# EAGLE design EC-TDS-PPM_V2-8 (EAGLE 7.5.0)
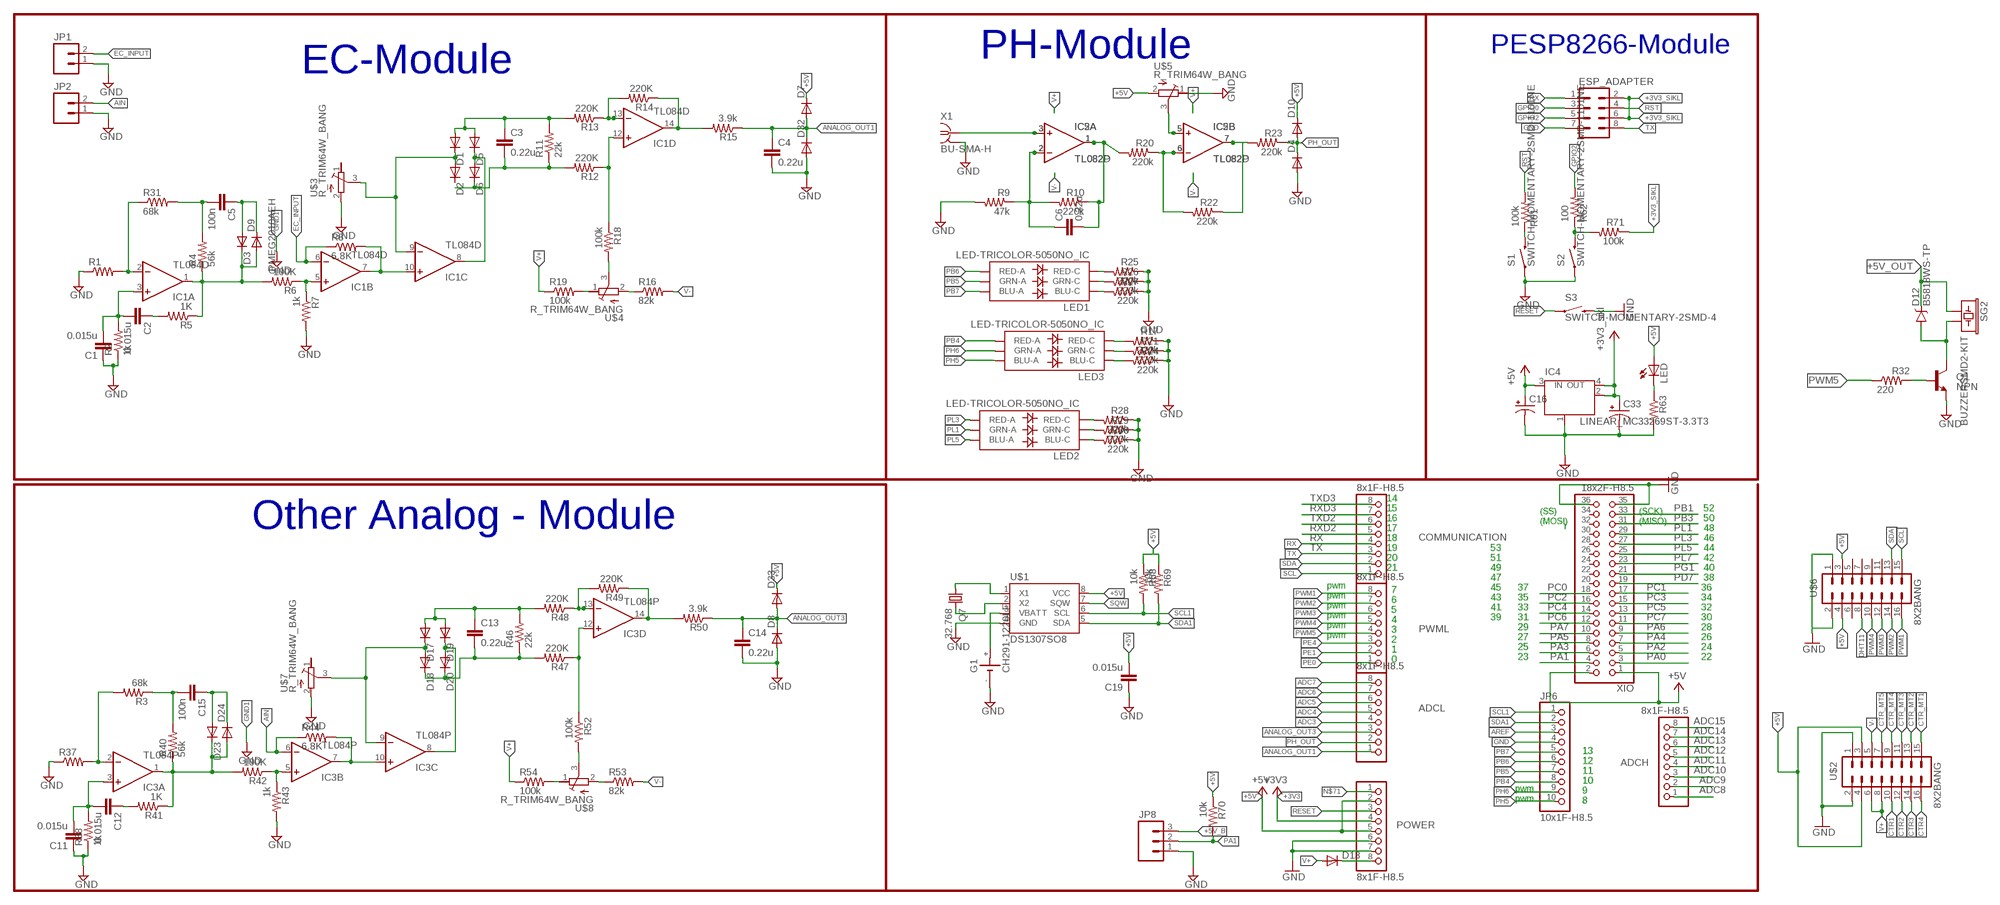
[diagram p0: schematic, sheet 1]

## Parts
ADCH  8x1F-H8.5  PINHD-1X8  [1X08]
ADCL  8x1F-H8.5  PINHD-1X8  [1X08]
C1  0.015u  C-EUC0603  [C0603]
C2  0.015u  C-EUC0603  [C0603]
C3  0.22u  C-EUC0603  [C0603]
C4  0.22u  C-EUC0603  [C0603]
C5  100n  C-EUC0603  [C0603]
C6  0.22u  C-EUC0603  [C0603]
C11  0.015u  C-EUC0603  [C0603]
C12  0.015u  C-EUC0603  [C0603]
C13  0.22u  C-EUC0603  [C0603]
C14  0.22u  C-EUC0603  [C0603]
C15  100n  C-EUC0603  [C0603]
C16  CPOL-USSMCC  [SMC_C]
C19  0.015u  C-EUC0603  [C0603]
C33  CPOL-USSMCC  [SMC_C]
COMMUNICATION  8x1F-H8.5  PINHD-1X8  [1X08]
D1  PMEG2010AEH  DIOD_SOT123F  [SOT123F]
D2  PMEG2010AEH  DIOD_SOT123F  [SOT123F]
D3  PMEG2010AEH  DIOD_SOT123F  [SOT123F]
D4  PMEG2010AEH  DIOD_SOT123F  [SOT123F]
D5  PMEG2010AEH  DIOD_SOT123F  [SOT123F]
D6  PMEG2010AEH  DIOD_SOT123F  [SOT123F]
D7  PMEG2010AEH  DIOD_SOT123F  [SOT123F]
D8  PMEG2010AEH  DIOD_SOT123F  [SOT123F]
D9  PMEG2010AEH  DIOD_SOT123F  [SOT123F]
D10  PMEG2010AEH  DIOD_SOT123F  [SOT123F]
D12  B5818WS-TP  DIODE-SCHOTTKY-BAT20J  [SOD-323]
D13  PMEG2010AEH  DIOD_SOT123F  [SOT123F]
D17  PMEG2010AEH  DIOD_SOT123F  [SOT123F]
D18  PMEG2010AEH  DIOD_SOT123F  [SOT123F]
D19  PMEG2010AEH  DIOD_SOT123F  [SOT123F]
D20  PMEG2010AEH  DIOD_SOT123F  [SOT123F]
D23  PMEG2010AEH  DIOD_SOT123F  [SOT123F]
D24  PMEG2010AEH  DIOD_SOT123F  [SOT123F]
D32  PMEG2010AEH  DIOD_SOT123F  [SOT123F]
D33  PMEG2010AEH  DIOD_SOT123F  [SOT123F]
ESP_ADAPTER  M04X2  [2X4]
G1  CH291-1220LF  [CH291-1220LF]
IC1  TL084D  [SO14]
IC2  TL082P  [DIL08]
IC3  TL084P  [DIL14]
IC4  LINEAR_MC33269ST-3.3T3  [LINEAR_SOT223]
IC5  TL082D  [SO08]
JP1  M025MM  [SCREWTERMINAL-5MM-2]
JP2  M025MM  [SCREWTERMINAL-5MM-2]
JP6  10x1F-H8.5  PINHD-1X10_ARD  [1X10]
JP8  M03PTH  [1X03]
LED  SPARKFUN_LED0603  [SPARKFUN_LED-0603]
LED1  LED-TRICOLOR-5050NO_IC  [LED-TRICOLOR-5050]
LED2  LED-TRICOLOR-5050NO_IC  [LED-TRICOLOR-5050]
LED3  LED-TRICOLOR-5050NO_IC  [LED-TRICOLOR-5050]
POWER  8x1F-H8.5  PINHD-1X8  [1X08]
PWML  8x1F-H8.5  PINHD-1X8  [1X08]
Q1  NPN  TRANSISTOR_NPNSOT23-3  [SOT23-3]
Q7  32.768  CRYTALTC38H  [TC38H]
R1  R-US_R0603  [R0603]
R2  1k  R-US_R0603  [R0603]
R3  68k  R-US_R0603  [R0603]
R4  56k  R-US_R0603  [R0603]
R5  1K  R-US_R0603  [R0603]
R6  100K  R-US_R0603  [R0603]
R7  1k  R-US_R0603  [R0603]
R8  6.8K  R-US_R0603  [R0603]
R9  47k  R-US_R0603  [R0603]
R10  220k  R-US_R0603  [R0603]
R11  22k  R-US_R0603  [R0603]
R12  220K  R-US_R0603  [R0603]
R13  220K  R-US_R0603  [R0603]
R14  220K  R-US_R0603  [R0603]
R15  3.9k  R-US_R0603  [R0603]
R16  82k  R-US_R0603  [R0603]
R17  220k  R-US_R0603  [R0603]
R18  100k  R-US_R0603  [R0603]
R19  100k  R-US_R0603  [R0603]
R20  220k  R-US_R0603  [R0603]
R21  220k  R-US_R0603  [R0603]
R22  220k  R-US_R0603  [R0603]
R23  220k  R-US_R0603  [R0603]
R24  220k  R-US_R0603  [R0603]
R25  220k  R-US_R0603  [R0603]
R26  220k  R-US_R0603  [R0603]
R27  220k  R-US_R0603  [R0603]
R28  220k  R-US_R0603  [R0603]
R29  220k  R-US_R0603  [R0603]
R30  220k  R-US_R0603  [R0603]
R31  68k  R-US_R0603  [R0603]
R32  220  RESISTOR0603-RES  [0603-RES]
R37  R-US_R0603  [R0603]
R38  1k  R-US_R0603  [R0603]
R40  56k  R-US_R0603  [R0603]
R41  1K  R-US_R0603  [R0603]
R42  100K  R-US_R0603  [R0603]
R43  1k  R-US_R0603  [R0603]
R44  6.8K  R-US_R0603  [R0603]
R46  22k  R-US_R0603  [R0603]
R47  220K  R-US_R0603  [R0603]
R48  220K  R-US_R0603  [R0603]
R49  220K  R-US_R0603  [R0603]
R50  3.9k  R-US_R0603  [R0603]
R52  100k  R-US_R0603  [R0603]
R53  82k  R-US_R0603  [R0603]
R54  100k  R-US_R0603  [R0603]
R61  100k  R-US_R0603  [R0603]
R62  100  R-US_R0603  [R0603]
R63  SPARKFUN_RESISTOR0603-RES  [SPARKFUN_0603-RES]
R68  10k  R-US_R0603  [R0603]
R69  10k  R-US_R0603  [R0603]
R70  10k  R-US_R0603  [R0603]
R71  100k  R-US_R0603  [R0603]
S1  SWITCH-MOMENTARY-2SMD-1101NE  [TACTILE-SWITCH-1101NE]
S2  SWITCH-MOMENTARY-2SMD-1101NE  [TACTILE-SWITCH-1101NE]
S3  SWITCH-MOMENTARY-2SMD-4  [TACTILE_SWITCH_TALL]
SG2  BUZZERSMD2-KIT  [BUZZER-CCV-KIT]
U$1  DS1307SO8  [SO08]
U$2  8X2BANG  [8X2BANG]
U$3  R_TRIM64W_BANG  [RTRIM64W_BANG]
U$4  R_TRIM64W_BANG  [RTRIM64W_BANG]
U$5  R_TRIM64W_BANG  [RTRIM64W_BANG]
U$6  8X2BANG  [8X2BANG]
U$7  R_TRIM64W_BANG  [RTRIM64W_BANG]
U$8  R_TRIM64W_BANG  [RTRIM64W_BANG]
X1  BU-SMA-H  [BU-SMA-H]
XIO  18x2F-H8.5  PINHD-2X18  [2X18]

## Nets
+3V3: POWER.4
+3V3_SIKL: C33.+ ESP_ADAPTER.2 ESP_ADAPTER.6 IC4.2(OUT) IC4.4(OUT) R71.1 ; supply symbol labelled +3V3_sikl
+5V: C16.+ C19.2 D7.C D10.C D33.C IC4.3(IN) LED.A POWER.2 POWER.5 R68.1 R69.1 R70.1 U$1.8(VCC) U$2.3 U$2.4 U$5.2(E) U$6.3 U$6.4
+5V_B: JP8.3 XIO.1 XIO.2 ; supply symbol labelled +5V
+5V_OUT: D12.C SG2.+
ADC3: ADCL.4
ADC4: ADCL.5
ADC5: ADCL.6
ADC6: ADCL.7
ADC7: ADCL.8
ADC8: ADCH.1
ADC9: ADCH.2
ADC10: ADCH.3
ADC11: ADCH.4
ADC12: ADCH.5
ADC13: ADCH.6
ADC14: ADCH.7
ADC15: ADCH.8
AIN: IC3.6(B:-IN) JP2.2 R44.1
ANALOG_OUT1: ADCL.1 C4.1 D7.A D32.C R15.1
ANALOG_OUT3: ADCL.3 C14.1 D8.C D33.A R50.1
AREF: JP6.3
CTR1: U$2.10
CTR2: U$2.12
CTR3: U$2.14
CTR4: U$2.16
CTR_MT1: U$2.15
CTR_MT2: U$2.13
CTR_MT3: U$2.11
CTR_MT4: U$2.9
CTR_MT5: U$2.7
DHT11: U$6.8
EC_INPUT: IC1.6(B:-IN) JP1.2 R8.1
GND: C1.1 C4.2 C11.1 C14.2 C16.- C19.1 C33.- D4.A D8.A D32.A ESP_ADAPTER.7 G1.- IC4.1(GND/ADJ) JP1.1 JP2.1 JP6.4 JP8.1 POWER.6 POWER.7 Q1.2(E) R1.1 R2.1 R7.2 R9.2 R17.1 R21.1 R24.1 R25.1 R26.1 R27.1 R28.1 R29.1 R30.1 R37.1 R38.1 R43.2 R63.2 S1.1 S2.1 S3.B2 U$1.4(GND) U$2.1 U$2.2 U$3.2(E) U$6.1 U$6.2 U$7.2(E) X1.2 X1.3 X1.4 X1.5 XIO.35 XIO.36
GND1: U$5.1(A) ; supply symbol labelled GND
GPIO0: ESP_ADAPTER.3
GPIO2: ESP_ADAPTER.5 R62.2
N$1: IC1.2(A:-IN) R1.2 R31.1
N$2: C2.1 R5.2
N$3: C1.2 C2.2 IC1.3(A:+IN) R2.2
N$4: IC1.5(B:+IN) R6.1 R7.1
N$5: C5.2 R4.2 R31.2
N$6: R16.1 U$4.2(E)
N$7: D3.C D9.A IC1.1(A:OUT) R4.1 R5.1 R6.2
N$8: C5.1 D3.A D9.C
N$9: IC1.7(B:OUT) IC1.10(C:+IN) R8.2
N$10: R19.2 U$4.1(A)
N$11: IC1.13(D:-IN) R13.1 R14.2
N$12: C3.1 D1.A D5.A R11.2 R13.2
N$13: D1.C D2.A IC1.9(C:-IN) U$3.3(S)
N$14: C3.2 D6.C R11.1 R12.2
N$15: D5.C D6.A IC1.8(C:OUT)
N$16: IC1.12(D:+IN) R12.1 R18.1
N$17: IC1.14(D:OUT) R14.1 R15.2
N$18: R18.2 U$4.3(S)
N$19: IC2.5(B:+IN) IC5.5(B:+IN) U$5.3(S)
N$20: IC2.6(B:-IN) IC5.6(B:-IN) R20.1 R22.2
N$21: C6.1 IC2.2(A:-IN) IC5.2(A:-IN) R9.1 R10.2
N$22: C6.2 IC2.1(A:OUT) IC5.1(A:OUT) R10.1 R20.2
N$23: IC2.7(B:OUT) IC5.7(B:OUT) R22.1 R23.2
N$24: IC2.3(A:+IN) IC5.3(A:+IN) X1.1
N$25: LED3.5(RED-C) R17.2
N$26: LED3.6(GRN-C) R21.2
N$27: LED2.5(RED-C) R28.2
N$28: LED2.6(GRN-C) R29.2
N$29: LED2.4(BLU-C) R30.2
N$30: LED3.4(BLU-C) R24.2
N$31: LED1.5(RED-C) R25.2
N$32: LED1.6(GRN-C) R26.2
N$33: LED1.4(BLU-C) R27.2
N$35: Q1.1(B) R32.2
N$36: D12.A Q1.3(C) SG2.-
N$37: IC3.2(A:-IN) R3.2 R37.2
N$38: C11.2 C12.2 IC3.3(A:+IN) R38.2
N$39: C15.2 R3.1 R40.2
N$40: D23.C D24.A IC3.1(A:OUT) R40.1 R41.1 R42.2
N$41: C12.1 R41.2
N$42: IC3.5(B:+IN) R42.1 R43.1
N$43: IC3.7(B:OUT) IC3.10(C:+IN) R44.2
N$44: C13.1 D17.A D19.A R46.2 R48.2
N$45: D17.C D18.A IC3.9(C:-IN) U$7.3(S)
N$46: C13.2 D18.C D20.C R46.1 R47.2
N$47: D19.C D20.A IC3.8(C:OUT)
N$48: IC3.13(D:-IN) R48.1 R49.2
N$49: IC3.12(D:+IN) R47.1 R52.1
N$50: IC3.14(D:OUT) R49.1 R50.2
N$51: C15.1 D23.A D24.C
N$52: R53.1 U$8.2(E)
N$53: R54.2 U$8.1(A)
N$54: R52.2 U$8.3(S)
N$55: D13.C POWER.8
N$62: R61.1 S1.2
N$63: R62.1 R71.2 S2.2
N$64: LED.C R63.1
N$68: Q7.1 U$1.1(X1)
N$69: Q7.2 U$1.2(X2)
N$71: POWER.1
N$72: G1.+ U$1.3(VBATT)
PA0: XIO.3
PA1: JP8.2 R70.2 XIO.4
PA2: XIO.5
PA3: XIO.6
PA4: XIO.7
PA5: XIO.8
PA6: XIO.9
PA7: XIO.10
PB1: XIO.33
PB3: XIO.31
PB4: JP6.8 LED3.2(RED-A)
PB5: JP6.7 LED1.1(GRN-A)
PB6: JP6.6 LED1.2(RED-A)
PB7: JP6.5 LED1.3(BLU-A)
PC0: XIO.18
PC1: XIO.17
PC2: XIO.16
PC3: XIO.15
PC4: XIO.14
PC5: XIO.13
PC6: XIO.12
PC7: XIO.11
PD7: XIO.19
PE0: PWML.1
PE1: PWML.2
PE4: PWML.3
PG1: XIO.21
PH5: JP6.10 LED3.3(BLU-A)
PH6: JP6.9 LED3.1(GRN-A)
PH_OUT: ADCL.2 D4.C D10.A R23.1
PL1: LED2.1(GRN-A) XIO.29
PL3: LED2.2(RED-A) XIO.27
PL5: LED2.3(BLU-A) XIO.25
PL7: XIO.23
PWM1: PWML.8 U$6.16
PWM2: PWML.7 U$6.14
PWM3: PWML.6 U$6.12
PWM4: PWML.5 U$6.10
PWM5: PWML.4 R32.1
RESET: POWER.3 S3.A2
RST: ESP_ADAPTER.4 R61.2
RX: COMMUNICATION.4 ESP_ADAPTER.1
RXD2: COMMUNICATION.5
RXD3: COMMUNICATION.7
SCL: COMMUNICATION.1 U$6.15
SCL1: JP6.1 R68.2 U$1.6(SCL)
SDA: COMMUNICATION.2 U$6.13
SDA1: JP6.2 R69.2 U$1.5(SDA)
SQW: U$1.7(SQW)
TX: COMMUNICATION.3 ESP_ADAPTER.8
TXD2: COMMUNICATION.6
TXD3: COMMUNICATION.8
V+: D13.A R19.1 R54.1 U$2.6 U$2.8
V-: R16.2 R53.2 U$2.5
Unconnected: D2.C U$3.1(A) U$6.5 U$6.6 U$6.7 U$6.9 U$6.11 U$7.1(A) XIO.20 XIO.22 XIO.24 XIO.26 XIO.28 XIO.30 XIO.32 XIO.34

## Notes on the sheet
- PH-Module | PESP8266-Module
- EC-Module
- 14
- 15 | (SS) | (SCK) | 52
- 16 | (MOSI) | (MISO) | 50
- Other Analog - Module | 17 | 48
- 18 | 46
- 19 | 53 | 44
- 20 | 51 | 42
- 21 | 49 | 40
- 47 | 38
- pwm | 45 | 37 | 36
- 7
- pwm | 43 | 35 | 34
- 6
- pwm | 41 | 33 | 32
- 5
- pwm | 39 | 31 | 30
- 4
- pwm | 29 | 28
- 3
- pwm | 27 | 26
- 2
- 1 | 25 | 24
- 0 | 23 | 22
- 13
- 12
- 11
- 10
- pwm | 9
- pwm | 8

## Power pins joined to a net without a drawn wire
V+: IC1.4(P:V+) IC2.8(P:V+) IC3.4(P:V+) IC5.8(P:V+)
V-: IC1.11(P:V-) IC2.4(P:V-) IC3.11(P:V-) IC5.4(P:V-)

## Library data of the parts
ADCH ADCL COMMUNICATION POWER PWML = SmartPrj:PINHD-1X8: PIN HEADER
C1-C6 C11-C15 C19 = resistor:C-EU: CAPACITOR, European symbol
C16 C33 = rcl:CPOL-US: POLARIZED CAPACITOR, American symbol
D1-D10 D13 D17-D20 D23 D24 D32 D33 = Enleka_Diode:DIOD_SOT123F; PARTNO: PMEG2010AEH,115
D12 = SparkFun-DiscreteSemi:DIODE-SCHOTTKY: Schottky diodes in SFE's production catalog BAT20J 1A 23V 0.62Vf RB751 120mA 40V 0.37Vf PMEG4005EJ 0.5A 40V 0.42Vf MBRA140 1A 40V 0.5Vf B340A 3A 40V SMA; PARTNO: BAT20JFILM; PROD_ID: DIO-11623; VALUE: BAT20J
ESP_ADAPTER = SparkFun-Connectors:M04X2: .1" header, two rows of four.
G1 = battery:CH291-1220LF: Battery Holder, SMT, 12mm multicomp PART NO. CH291-1220LF Source: Data sheet <http://www.farnell.com/datasheets/1505860.pdf>
IC1 IC3 = linear:TL084: OP AMP
IC2 IC5 = linear:TL082: OP AMP Data sheet <http://www.ti.com/lit/ds/symlink/tl084a . pdf>; DATA_SHEET: <a href="http://www.ti.com/lit/ds/symlink/tl084a.pdf"> Data sheet </a>
IC4 = Robotech_Other:LINEAR_MC33269ST*: Adjustable Output Low Dropout Voltage Regulator 800 mA Source: http://www.onsemi.com/pub/Collateral/MC33269-D.PDF
JP1 JP2 = SparkFun-Connectors:M02: Standard 2-pin 0.1" header. Use with - straight break away headers ( PRT-00116) - right angle break away headers (PRT-00553) - swiss pins (PRT-00743) - machine pins (PRT-00117) - female headers (PRT-00115) Molex polarized connector foot print use with: PRT-08233 with associated crimp pins and housings. 2.54_SCREWTERM for use with PRT-10571. 3.5mm Screw Terminal footprints for PRT-08084 5mm Screw Terminal footprints for use with PRT-08432; STOREFRONT_ID: PRT-08432
JP6 = SmartPrj:PINHD-1X10_ARD: PIN HEADER
JP8 = SparkFun-Connectors:M03: Header 3 Standard 3-pin 0.1" header. Use with straight break away headers (SKU : PRT-00116), right angle break away headers (PRT-00553), swiss pins (PRT-00743), machine pins (PRT-00117), and female headers (PRT-00115). Molex polarized connector foot print use with SKU : PRT-08232 with associated crimp pins and housings.
LED = Robotech RLC of Chung:SPARKFUN_LED: LEDs Standard schematic elements and footprints for 5mm, 3mm, 1206, and 0603 sized LEDs. 5mm - Spark Fun Electronics SKU : COM-00529 (and others)
LED1-LED3 = SparkFun-LED:LED-TRICOLOR-5050
Q1 = SparkFun-DiscreteSemi:TRANSISTOR_NPN: Generic NPN BJT MMBT2222A - TRANS-08049 (SOT-23, 1A 40V) MPSA42 - TRANS-09116 (SOT-23, 500mA 300V) MMBT5088LT1G - TRANS-11160 (SOT-23, 50 mA 30V) BC547 - COM-08928 <http://www.sparkfun.com/products/8928> (TO-92 45V 100mA) (1.Collector 2.Base 3.Emitter) 2N3904 - COM-00521 <http://www.sparkfun.com/products/521> (TO-92 40V 200mA) (1.Emitter 2.Base 3.Collector) P2N2222A - COM-12852 <http://www.sparkfun.com/products/12852> (TO-92 40V 600mA) (1.Collector 2.Base 3.Emitter); PARTNO: 2SD1048-6-TB-E; PROD_ID: TRANS-08049
Q7 = crystal:CRYTAL: CRYSTAL
R1-R31 R37 R38 R40-R44 R46-R50 R52-R54 R61 R62 R68-R71 = resistor:R-US_: RESISTOR, American symbol
R32 = pixhawk2:RESISTOR: Resistor Basic schematic elements and footprints for 0603, 1206, and PTH 1/10th watt (small) resistors.; PARTNO: RT0402DRE079K09L
R63 = Robotech_RCL:SPARKFUN_RESISTOR: Resistor Basic schematic elements and footprints for 0603, 1206, and PTH resistors.
S1 S2 = SparkFun-Electromechanical:SWITCH-MOMENTARY-2: Various NO switches- pushbuttons, reed, etc; PROD_ID: SWCH-00815
S3 = SparkFun-Electromechanical:SWITCH-MOMENTARY-2: Various NO switches- pushbuttons, reed, etc; PROD_ID: SWCH-11966
SG2 = buzzer-greentura:BUZZER: Buzzer 12mm Spark Fun Electronics SKU : Comp-Buzzer
U$1 = SparkFun-FreqCtrl:DS1307: I2C real-time clock with battery backup.
U$2 U$6 = SparkFun-Connectors:8X2BANG
U$3-U$5 U$7 U$8 = rtrim:R_TRIM64W_BANG
X1 = con-coax:BU-SMA-H: FEMALE SMA CONNECTOR Radiall; OC_FARNELL: unknown; OC_NEWARK: unknown
XIO = SmartPrj:PINHD-2X18: PIN HEADER

## Net classes
0 default: width 0.178 mm, drill 0.381 mm, clearance 0.178 mm
1 power: width 0.15 mm, drill 0.2 mm, clearance 0.152 mm
2 gnd: width 0.305 mm, drill 0.406 mm, clearance 0.203 mm
3 power usb: width 0.508 mm, drill 0.406 mm, clearance 0.203 mm

## Board
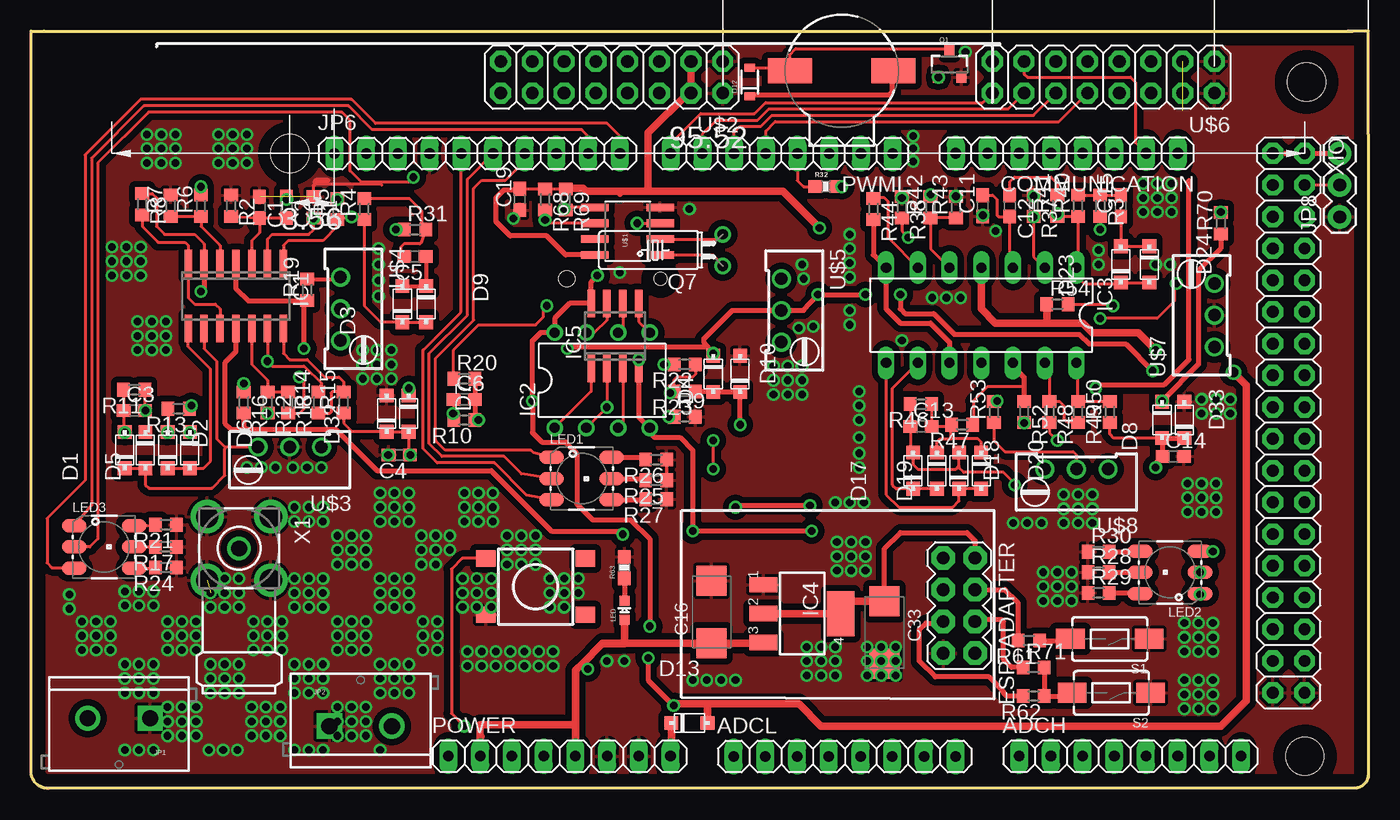
[diagram p1: board, top side]
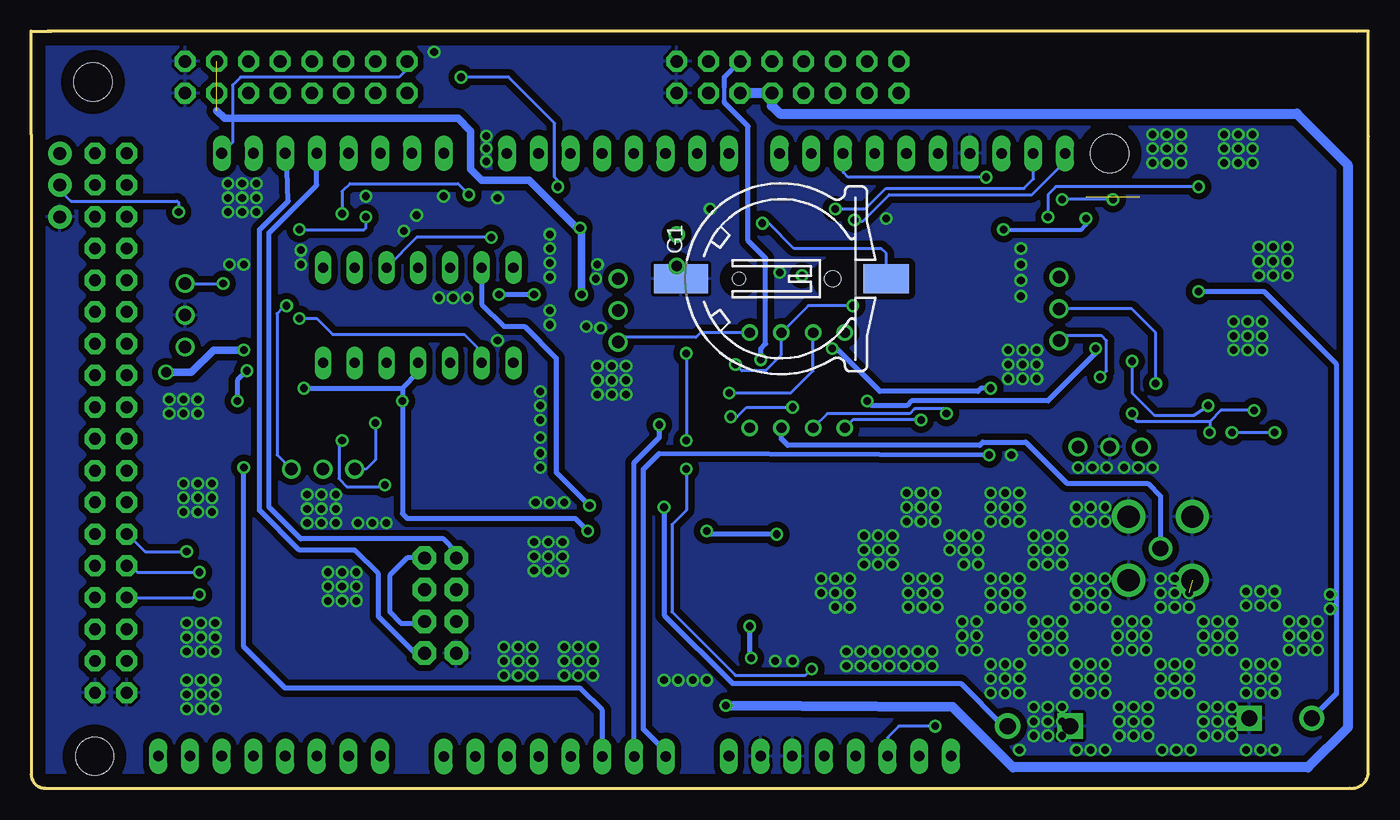
[diagram p2: board, bottom side, seen from below]

Size 107.06 x 60.6 mm. Coordinates in mm from the lower left corner, seen from the top.
Outline: 0,52.19 0,1.14 arc90 1.51,0.01 105.97,0.01 arc90 107.06,1.11 107.06,52.33
Outline: 0.91,60.59 105.79,60.59
Outline: 0,52.21 0,60.6 1.02,60.6
Outline: 107.06,52.34 107.06,60.6 105.41,60.6
Copper layers (1*16): Top 0.035mm / dielectric 1.5mm / Bottom 0.035mm
Design rules "default *": minimum track width 10mil, minimum drill 24mil, track to track 10mil, track to pad 10mil, pad to pad 10mil, via to via 10mil, smd to smd 8mil, copper to edge 40mil, drill to drill 8mil, minimum pad ring 10mil, minimum via ring 8mil, stop-mask expansion 4mil, vias tented up to drill 100mil, thermal gap 10mil
Holes 3.05 mm at 20.7,50.82 101.98,2.56 102.11,56.53

### Footprints (pad centres in the part's own frame; a part is rotated, then mirrored left to right if it is on the bottom)
1X08 = drill 0.85 pad 1.422 long: 1 -8.89,0; 2 -6.35,0; 3 -3.81,0; 4 -1.27,0; 5 1.27,0; 6 3.81,0; 7 6.35,0; 8 8.89,0
C0603 = smd 1.1 x 1: 1 -0.85,0; 2 0.85,0
SMC_C = smd 2.4 x 2.4: + -2.5,0; - 2.5,0
SOT123F = smd 1.1 x 1.1: A 1.45,0; C -1.45,0
SOD-323 = smd 0.63 x 0.83: A 1.15,0; C -1.15,0
2X4 = drill 1.016 pad 1.88 octagon: 1 -3.81,-1.27; 2 -3.81,1.27; 3 -1.27,-1.27; 4 -1.27,1.27; 5 1.27,-1.27; 6 1.27,1.27; 7 3.81,-1.27; 8 3.81,1.27
CH291-1220LF = smd 2.3 x 3.66: + 0,-2.296 | smd 2.3 x 4.3: - 0,14.146 | hole 1.3: 0,2 | hole 1: 0,9.5
SO14 = smd 0.6 x 2.2: 1 -3.81,-2.6; 2 -2.54,-2.6; 3 -1.27,-2.6; 4 0,-2.6; 5 1.27,-2.6; 6 2.54,-2.6; 7 3.81,-2.6; 8 3.81,2.6; 9 2.54,2.6; 10 1.27,2.6; 11 0,2.6; 12 -1.27,2.6; 13 -2.54,2.6; 14 -3.81,2.6
DIL08 = drill 0.813 pad 1.27: 1 -3.81,-3.81; 2 -1.27,-3.81; 3 1.27,-3.81; 4 3.81,-3.81; 5 3.81,3.81; 6 1.27,3.81; 7 -1.27,3.81; 8 -3.81,3.81
DIL14 = drill 0.813 long: 1 -7.62,-3.81; 2 -5.08,-3.81; 3 -2.54,-3.81; 4 0,-3.81; 5 2.54,-3.81; 6 5.08,-3.81; 7 7.62,-3.81; 8 7.62,3.81; 9 5.08,3.81; 10 2.54,3.81; 11 0,3.81; 12 -2.54,3.81; 13 -5.08,3.81; 14 -7.62,3.81
LINEAR_SOT223 = smd 1.219 x 2.235: 1 -2.311,-3.099; 2 0,-3.099; 3 2.311,-3.099 | smd 3.6 x 2.2: 4 0,3.099
SO08 = smd 0.6 x 2.2: 1 -1.905,-2.6; 2 -0.635,-2.6; 3 0.635,-2.6; 4 1.905,-2.6; 5 1.905,2.6; 6 0.635,2.6; 7 -0.635,2.6; 8 -1.905,2.6
SCREWTERMINAL-5MM-2 = drill 1.3 pad 2.032 square: 1 0,0 | drill 1.3 pad 2.032: 2 5,0
1X10 = drill 0.85 pad 1.422 long: 1 -11.43,0; 2 -8.89,0; 3 -6.35,0; 4 -3.81,0; 5 -1.27,0; 6 1.27,0; 7 3.81,0; 8 6.35,0; 9 8.89,0; 10 11.43,0
1X03 = drill 1.016 pad 1.88: 1 0,0; 2 2.54,0; 3 5.08,0
SPARKFUN_LED-0603 = smd 0.8 x 0.8: A 0,-0.75; C 0,0.75
LED-TRICOLOR-5050 = smd 2 x 1.1: 1 -2.4,1.7; 2 -2.4,0; 3 -2.4,-1.7; 4 2.4,-1.7; 5 2.4,0; 6 2.4,1.7
SOT23-3 = smd 0.8 x 0.9: 1 -0.95,-1; 2 0.95,-1; 3 0,1.1
TC38H = drill 0.813: 1 -1.27,0; 2 1.27,0
R0603 = smd 1 x 1.1: 1 -0.85,0; 2 0.85,0
0603-RES = smd 1.1 x 1: 1 -0.85,0; 2 0.85,0
SPARKFUN_0603-RES = smd 1.1 x 1: 1 -0.85,0; 2 0.85,0
TACTILE-SWITCH-1101NE = smd 2.3 x 1.6: 1 -3.15,0; 2 3.15,0
TACTILE_SWITCH_TALL = smd 1.55 x 1.3: A1 -3.975,-2.25; A2 3.975,-2.25; B1 -3.975,2.25; B2 3.975,2.25
BUZZER-CCV-KIT = smd 3.5 x 2: + 4.15,0; - -4.15,0
SO08' = smd 0.61 x 2.21: 1 -1.905,-2.616; 2 -0.635,-2.616; 3 0.635,-2.616; 4 1.905,-2.616; 5 1.905,2.616; 6 0.635,2.616; 7 -0.635,2.616; 8 -1.905,2.616
8X2BANG = drill 1.016 pad 1.676 octagon: 1 0,0; 2 0,2.54; 3 2.54,0; 4 2.54,2.54; 5 5.08,0; 6 5.08,2.54; 7 7.62,0; 8 7.62,2.54; 9 10.16,0; 10 10.16,2.54; 11 12.7,0; 12 12.7,2.54; 13 15.24,0; 14 15.24,2.54; 15 17.78,0; 16 17.78,2.54
RTRIM64W_BANG = drill 1: 1 2.54,-2.54; 2 2.54,0; 3 2.54,2.54
BU-SMA-H = drill 1.27: 1 0,0 | drill 1.778: 2 -2.55,2.55; 3 2.55,2.55; 4 2.55,-2.55; 5 -2.55,-2.55
2X18 = drill 0.95 pad 1.676 octagon: 1 -21.59,-1.27; 2 -21.59,1.27; 3 -19.05,-1.27; 4 -19.05,1.27; 5 -16.51,-1.27; 6 -16.51,1.27; 7 -13.97,-1.27; 8 -13.97,1.27; 9 -11.43,-1.27; 10 -11.43,1.27; 11 -8.89,-1.27; 12 -8.89,1.27; 13 -6.35,-1.27; 14 -6.35,1.27; 15 -3.81,-1.27; 16 -3.81,1.27; 17 -1.27,-1.27; 18 -1.27,1.27; 19 1.27,-1.27; 20 1.27,1.27; 21 3.81,-1.27; 22 3.81,1.27; 23 6.35,-1.27; 24 6.35,1.27; 25 8.89,-1.27; 26 8.89,1.27; 27 11.43,-1.27; 28 11.43,1.27; 29 13.97,-1.27; 30 13.97,1.27; 31 16.51,-1.27; 32 16.51,1.27; 33 19.05,-1.27; 34 19.05,1.27; 35 21.59,-1.27; 36 21.59,1.27

### Placement (x,y rotation side)
ADCH  88,2.57 0 top
ADCL  65.14,2.54 0 top
C1  18.29,46.5 270 top
C2  20.45,46.5 270 top
C3  8.25,30.24 0 top
C4  29.46,26.69 180 top
C5  30.73,42.56 180 top
C6  34.67,31.13 0 top
C11  76.2,46.63 90 top
C12  78.36,46.63 270 top
C13  71.25,28.97 0 top
C14  91.44,26.56 0 top
C15  87.25,46.63 90 top
C16  54.48,14.11 90 top
C19  39.12,47.13 90 top
C33  68.33,12.46 270 top
COMMUNICATION  82.92,50.83 180 top
D1  7.49,27.07 90 top
D2  9.14,27.07 270 top
D3  29.72,38.75 90 top
D4  56.77,33.16 90 top
D5  10.92,27.07 90 top
D6  12.7,27.07 270 top
D7  30.23,29.99 270 top
D8  92.33,29.48 90 top
D9  31.62,38.75 270 top
D10  54.61,33.16 270 top
D12  57.53,56.53 90 top
D13  52.7,5.22 0 top
D17  70.61,25.42 90 top
D18  72.52,25.42 270 top
D19  74.3,25.42 90 top
D20  76.07,25.42 270 top
D23  87.25,41.93 90 top
D24  89.54,41.93 270 top
D32  28.45,29.99 90 top
D33  90.55,29.48 270 top
ESP_ADAPTER  74.3,14.62 270 top
G1  40.89,40.78 90 bottom
IC1  16.38,39.39 180 top
IC2  45.72,32.66 0 top
IC3  76.07,37.86 180 top
IC4  61.72,13.99 270 top
IC5  46.74,36.21 0 top
JP1  9.52,5.61 180 top
JP2  23.88,4.97 0 top
JP6  35.71,50.82 0 top
JP8  104.78,45.74 90 top
LED  47.5,14.24 0 top
LED1  44.07,24.78 0 top
LED2  91.19,17.29 180 top
LED3  5.84,19.32 0 top
POWER  42.3,2.57 0 top
PWML  60.08,50.8 180 top
Q1  73.53,57.93 0 top
Q7  55.37,43.07 90 top
R1  22.61,46.5 270 top
R2  16,46.63 270 top
R3  85.6,46.63 270 top
R4  26.67,46.37 90 top
R5  24.51,46.37 90 top
R6  13.59,46.63 90 top
R7  11.18,46.63 90 top
R8  8.89,46.75 270 top
R9  52.32,29.74 0 top
R10  34.67,29.48 180 top
R11  8.25,31.89 180 top
R12  18.92,30.88 270 top
R13  11.81,30.37 180 top
R14  22.99,30.88 90 top
R15  25.02,30.88 90 top
R16  17.02,30.88 270 top
R17  10.79,19.32 180 top
R18  20.57,30.88 270 top
R19  22.1,39.9 90 top
R20  34.67,32.78 0 top
R21  10.79,21.1 180 top
R22  52.32,33.93 180 top
R23  52.32,31.77 180 top
R24  10.79,17.67 180 top
R25  50.04,24.66 180 top
R26  50.04,26.31 180 top
R27  50.04,23.13 180 top
R28  85.47,17.29 0 top
R29  85.47,15.64 0 top
R30  85.47,18.94 0 top
R31  30.73,44.72 0 top
R32  63.63,48.15 0 top
R37  80.26,46.63 270 top
R38  69.72,46.5 270 top
R40  83.82,46.63 90 top
R41  82.17,46.63 90 top
R42  72.01,46.5 90 top
R43  74.04,46.5 90 top
R44  67.44,46.37 270 top
R46  71.25,30.75 180 top
R47  74.55,29.1 180 top
R48  81.53,30.12 270 top
R49  83.82,30.12 270 top
R50  86.36,30.12 90 top
R52  79.5,30.12 270 top
R53  77.09,30.12 90 top
R54  82.17,38.75 0 top
R61  79.88,11.83 180 top
R62  80.26,7.38 180 top
R63  47.5,17.67 90 top
R68  41.15,47.13 270 top
R69  42.8,47.13 270 top
R70  95.25,45.23 90 top
R71  80.26,9.67 0 top
S1  86.36,11.96 180 top
S2  86.49,7.64 180 top
S3  40.39,16.15 180 top
SG2  64.9,57.42 0 top
U$1  DS1307SO8  [SO08']  47.75,44.59 90 top
U$2  55.37,58.18 180 top
U$3  20.7,24.78 90 top
U$4  27.3,38.37 180 top
U$5  62.61,38.24 180 top
U$6  94.74,58.18 180 top
U$7  92.2,37.86 0 top
U$8  83.69,23 90 top
X1  16.64,19.19 270 top
XIO  100.69,29.24 270 top

### Tracks (layer width: path | path; a pad name or v marks a point on that pad's centre or on a via)
+3V3_SIKL
  Top 0.381: C33.+ 68.33,19.19 69.6,20.46 74.93,20.46 75.56,19.83 ESP_ADAPTER.2 | R71.1 78.49,9.67 77.85,10.3 77.85,13.35 77.72,13.48 75.69,13.48 ESP_ADAPTER.6 | IC4.4 64.82,14.67 65.02,14.88
  Top 0.61: IC4.2 IC4.4 | C33.+ 64.22,14.96 64.01,14.75 64.75,14.75 64.82,14.67
  Bottom 0.381: ESP_ADAPTER.2 76.96,18.43 78.36,17.04 78.36,14.11 77.47,13.23 75.69,13.23 ESP_ADAPTER.6
+5V  (via drill 0.61)  (2 unrouted)
  Top 0.254: D10.C v54.61,34.82 | v54.61,27.83 v54.61,25.54 | v44.58,9.54 44.13,9.99 | C19.2 R68.1 R69.1
  Top 0.381: v66.8,39.51 v62.99,39.51 61.85,38.24 U$5.2 56.13,38.24 53.85,35.96 53.85,35.7 v54.61,34.82 | v89.79,33.42 87.63,35.58 84.71,35.58 83.95,36.34 73.91,36.34 72.26,37.99 69.98,37.99 69.6,38.37 v69.6,39.51 | D33.C v90.55,31.01 93.47,33.93 93.47,41.42 95.25,43.2 R70.1 | v42.93,35.2 43.18,35.07 43.43,35.32 54.15,35.32 D10.C | 47.12,47.52 47.37,47.77 | U$1.8 42.8,42.69 41.27,44.21 38.35,44.21 37.21,45.36 37.21,47.26 37.85,47.9 39.03,47.9 C19.2 | D7.C v30.23,32.02
  Top 0.61: LED.A 47.5,11.57 45.72,11.57 | IC4.3 58.78,11.83 59.18,11.83 58.97,11.61 C16.+ 45.76,11.61 45.72,11.57 | POWER.5 43.57,5.22 | 43.57,5.22 43.57,9.43 44.13,9.99 45.72,11.57 | POWER.2 35.95,4.08 | 35.95,4.08 35.95,4.48 35.94,5.1 43.45,5.1 43.57,5.22 | 36.02,4.14 35.95,4.08 | U$2.3 U$2.4 52.58,55.64 49.4,52.47 49.4,47.77 | 49.4,47.77 60.2,47.77 v63.12,44.85 | 49.4,47.77 47.37,47.77 44.45,47.77 44.2,48.02 42.84,48.02 R69.1
  Bottom 0.254: v54.61,34.82 v54.61,27.83 | v54.61,25.54 54.61,22.24 55.75,21.1 55.75,14.11 50.67,9.03 45.09,9.03 v44.58,9.54
  Bottom 0.381: 62.99,44.98 v63.12,44.85 | v66.8,39.51 v69.6,39.51 | v89.79,33.42 90.55,32.66 v90.55,31.01 | v30.23,32.02 30.99,32.02 31.24,31.77 39.12,31.77 42.42,35.07 v42.93,35.2
  Bottom 0.61: v62.99,39.51 62.99,44.98 63.5,44.98 67.18,48.66 70.99,48.66 71.88,49.55 71.88,52.6 72.9,53.61 91.57,53.61 92.2,54.25
+5V_B
  Top 0.381: XIO.1 XIO.2 104.76,50.83 JP8.3
+5V_OUT
  Top 0.254: 69.09,57.38 SG2.+ | D12.C 57.65,55.38 57.78,55.52
  Top 0.381: 57.78,55.52 68.71,55.52 68.96,55.77 68.96,57.34 SG2.+
AIN  (via drill 0.61)
  Top 0.254: IC3.6 68.58,44.09 68.58,47.01 68.33,47.26 67.48,47.26 R44.1
  Top 0.381: v62.36,22.62 56.52,22.62 v56.39,22.5
  Bottom 0.381: IC3.6 70.99,38.75 69.22,36.97 67.56,36.97 65.02,34.43 65.02,25.29 v62.36,22.62 | v56.39,22.5 56.39,13.86 50.93,8.4 32.64,8.4 29.34,5.1 29.13,5.1 JP2.2
ANALOG_OUT1  (via drill 0.61)
  Top 0.254: C4.1 30.23,26.78 D7.A D32.C 28.39,28.59 25.65,28.59 25.02,29.23 R15.1
  Top 0.381: v30.35,26.69 C4.1
  Bottom 0.381: ADCL.1 56.25,2.93 58.04,4.72 58.04,25.54 56.77,26.81 v30.35,26.69
ANALOG_OUT3  (via drill 0.61)
  Top 0.254: D33.A 86.67,28.03 86.36,28.34 R50.1
  Top 0.381: 90.04,25.58 v90.04,25.67 90.04,26.01 C14.1 90.55,26.6 D33.A D8.C
  Bottom 0.381: ADCL.3 61.33,6.23 63.12,8.02 86.74,8.02 90.04,11.32 v90.04,25.67
EC_INPUT  (via drill 0.61)
  Top 0.254: R8.1 9.69,47.6 10.03,47.26 10.03,44.98 10.67,44.34 13.08,44.34 13.84,43.58 IC1.6
  Top 0.381: IC1.6 13.84,40.02 v13.59,39.77
  Bottom 0.381: v13.59,39.77 8.38,39.77 2.54,33.93 2.54,7.59 JP1.2
GND  (via drill 0.61)  (2 unrouted)
  Top 0.254: R26.1 R25.1 | 23.75,48.66 23.62,48.79 23.24,48.79 22.61,48.15 R1.1 22.61,48.28 22.73,48.4 27.94,48.4 28.07,48.28
  Top 0.381: 23.75,48.66 22.86,48.66 22.73,48.53
  other vias: 46.1,10.18 47.5,10.18 52.96,8.65 54.1,8.65 55.24,8.65 56.39,8.65 34.92,9.8 36.07,9.8 37.21,9.8 38.35,9.8 39.5,9.8 40.64,9.8 41.78,9.8 34.92,10.94 36.07,10.94 37.21,10.94 38.35,10.94 39.5,10.94 40.64,10.94 41.78,10.94 62.1,11.32 63.25,11.32 64.39,11.32 62.1,10.18 63.25,10.18 64.39,10.18 66.93,11.32 68.07,11.32 69.22,11.32 66.93,10.18 68.07,10.18 69.22,10.18 93.73,31.13 94.87,31.13 96.01,31.13 93.73,29.99 94.87,29.99 96.01,29.99 92.33,10.94 93.47,10.94 94.62,10.94 92.33,13.23 93.47,13.23 94.62,13.23 92.33,12.08 93.47,12.08 94.62,12.08 92.33,8.65 93.47,8.65 94.62,8.65 92.33,7.51 93.47,7.51 94.62,7.51 92.58,22.12 93.73,22.12 94.87,22.12 92.58,24.4 93.73,24.4 94.87,24.4 92.58,23.26 93.73,23.26 94.87,23.26 81.03,15 82.17,15 83.31,15 81.03,17.29 82.17,17.29 83.31,17.29 81.03,16.15 82.17,16.15 83.31,16.15 59.44,31.51 60.58,31.51 61.72,31.51 59.44,33.8 60.58,33.8 61.72,33.8 59.44,32.66 60.58,32.66 61.72,32.66 8.51,35.07 9.65,35.07 10.79,35.07 8.51,37.36 9.65,37.36 10.79,37.36 8.51,36.21 9.65,36.21 10.79,36.21 6.48,41.04 7.62,41.04 8.76,41.04 6.48,43.32 7.62,43.32 6.48,42.18 7.62,42.18 8.76,42.18 16.13,50.06 16.13,51.2 16.13,52.34 17.27,50.06 17.27,51.2 17.27,52.34 14.99,50.06 14.99,51.2 14.99,52.34 11.56,50.06 11.56,51.2 11.56,52.34 9.27,50.06 9.27,51.2 9.27,52.34 10.41,50.06 10.41,51.2 10.41,52.34 21.08,21.35 22.23,21.35 23.37,21.35 21.08,22.5 22.23,22.5 23.37,22.5 24.51,17.92 25.65,17.92 26.8,17.92 24.51,20.21 25.65,20.21 26.8,20.21 24.51,19.07 25.65,19.07 26.8,19.07 27.94,14.5 29.08,14.5 30.23,14.5 27.94,16.78 29.08,16.78 30.23,16.78 27.94,15.64 29.08,15.64 30.23,15.64 31.37,11.07 32.51,11.07 31.37,13.35 32.51,13.35 31.37,12.21 32.51,12.21 31.24,17.92 32.38,17.92 31.24,20.21 32.38,20.21 33.53,20.21 31.24,19.07 32.38,19.07 33.53,19.07 27.94,21.35 29.08,21.35 30.23,21.35 27.94,23.64 29.08,23.64 30.23,23.64 27.94,22.5 29.08,22.5 30.23,22.5 21.08,14.5 22.23,14.5 23.37,14.5 21.08,16.78 22.23,16.78 23.37,16.78 21.08,15.64 22.23,15.64 23.37,15.64 24.51,11.07 25.65,11.07 26.8,11.07 24.51,13.35 25.65,13.35 26.8,13.35 24.51,12.21 25.65,12.21 26.8,12.21 7.49,14.62 8.64,14.62 9.78,14.62 7.49,15.77 8.64,15.77 9.78,15.77 10.92,11.07 12.06,11.07 13.21,11.07 10.92,13.35 12.06,13.35 13.21,13.35 10.92,12.21 12.06,12.21 13.21,12.21 7.49,7.64 8.64,7.64 9.78,7.64 7.49,9.92 8.64,9.92 9.78,9.92 7.49,8.78 8.64,8.78 9.78,8.78 14.35,7.64 15.49,7.64 16.64,7.64 14.35,9.92 15.49,9.92 16.64,9.92 14.35,8.78 15.49,8.78 16.64,8.78 17.78,11.07 18.92,11.07 20.07,11.07 17.78,13.35 18.92,13.35 20.07,13.35 17.78,12.21 18.92,12.21 20.07,12.21 17.65,4.21 18.8,4.21 19.94,4.21 17.65,6.49 18.8,6.49 19.94,6.49 17.65,5.35 18.8,5.35 19.94,5.35 21.08,7.64 22.23,7.64 23.37,7.64 21.08,9.92 22.23,9.92 23.37,9.92 21.08,8.78 22.23,8.78 23.37,8.78 27.94,7.64 29.08,7.64 30.23,7.64 27.94,9.92 29.08,9.92 30.23,9.92 27.94,8.78 29.08,8.78 30.23,8.78 14.35,14.5 15.49,14.5 16.64,14.5 14.35,16.78 15.49,16.78 16.64,16.78 14.35,15.64 15.49,15.64 16.64,15.64 4.06,11.07 5.21,11.07 6.35,11.07 4.06,13.35 5.21,13.35 6.35,13.35 4.06,12.21 5.21,12.21 6.35,12.21 10.92,4.21 12.06,4.21 13.21,4.21 10.92,6.49 12.06,6.49 13.21,6.49 10.92,5.35 12.06,5.35 13.21,5.35 14.22,3.07 15.37,3.07 16.51,3.07 7.49,3.07 8.64,3.07 9.78,3.07 34.67,21.35 35.81,21.35 36.96,21.35 34.67,23.64 35.81,23.64 36.96,23.64 34.67,22.5 35.81,22.5 36.96,22.5 64.52,17.42 65.66,17.42 66.8,17.42 64.52,19.7 65.66,19.7 66.8,19.7 64.52,18.56 65.66,18.56 66.8,18.56 38.1,17.92 39.24,17.92 40.39,17.92 38.1,20.21 39.24,20.21 40.39,20.21 38.1,19.07 39.24,19.07 40.39,19.07 41.53,14.5 42.67,14.5 41.53,16.78 42.67,16.78 43.81,16.78 41.53,15.64 42.67,15.64 43.81,15.64 34.54,14.5 35.69,14.5 36.83,14.5 34.54,16.78 35.69,16.78 36.83,16.78 34.54,15.64 35.69,15.64 36.83,15.64 24.51,4.21 25.65,4.21 26.8,4.21 24.51,6.49 25.65,6.49 26.8,6.49 24.51,5.35 25.65,5.35 26.8,5.35 27.94,3.07 21.08,3.07 22.23,3.07 23.37,3.07 8.76,43.32 66.93,9.03 68.07,9.03 69.22,9.03 64.39,9.03 63.25,9.03 62.1,9.03 92.33,6.37 93.47,6.37 94.62,6.37 3.05,14.37 3.05,15.51 28.58,26.69 26.54,32.78 27.69,32.78 28.83,32.78 26.54,35.07 27.69,35.07 28.83,35.07 26.54,33.93 27.69,33.93 28.83,33.93 17.27,25.67 18.42,25.67 19.56,25.67 20.96,25.67 22.1,25.67 23.24,25.67 27.81,43.2 27.81,41.93 27.81,40.66 27.81,39.39 73.28,39.26 69.72,35.83 76.2,45.86 80.26,47.39 65.53,40.91 65.53,42.05 65.53,43.2 65.53,44.34 77.22,44.59 74.04,47.39 69.72,47.26 61.72,41.93 61.85,40.78 61.47,36.85 62.61,36.97 65.53,38.24 65.53,37.1 66.29,31.77 66.29,30.62 66.29,29.48 66.29,28.08 66.29,26.81 66.29,25.67 72.14,39.26 74.42,39.26 85.47,43.07 85.47,41.93 90.04,41.93 91.19,41.93 90.17,46.12 91.31,46.12 89.03,48.4 90.17,48.4 91.31,48.4 89.03,47.26 90.17,47.26 91.31,47.26 89.03,46.12 64.39,22.88 65.53,22.88 66.68,22.88 78.61,21.23 79.76,21.23 80.9,21.23 82.68,21.23 83.82,21.23 84.96,21.23 74.8,58.95 52.7,46.37 47.12,41.29 38.61,45.61 70.61,52.21 70.61,51.2 70.61,50.18 82.68,22.37 83.82,22.37 84.96,22.37 82.68,23.51 83.82,23.51 84.96,23.51
  pour Top (isolate 0.508): 0,60.6 0,0.02 107.06,0.02 107.06,60.6
  pour Bottom (isolate 0.508): 0,60.6 0,0.02 107.06,0.02 107.06,60.6
GPIO2
  Top 0.381: R62.2 78.11,7.38 77.85,7.64 77.85,7.76 76.71,8.91 72.39,8.91 71.12,10.18 71.12,12.72 71.63,13.23 72.9,13.23 ESP_ADAPTER.5
N$1  (via drill 0.61)
  Top 0.254: IC1.2 18.92,43.96 19.3,44.34 22.23,44.34 22.61,44.72 R1.2
  Top 0.305: v22.61,45.61 R1.2
  Top 0.381: R31.1 v29.21,44.72
  Bottom 0.305: v29.21,44.72 22.99,44.72 22.61,45.1 v22.61,45.61
N$2  (via drill 0.61)
  Top 0.254: C2.1 20.92,47.35 v20.45,47.13 | v24.51,47.13 24.47,47.26 R5.2
  Bottom 0.254: v20.45,47.13 v24.51,47.13
N$3
  Top 0.254: R2.2 C1.2 | C1.2 C2.2 | C1.2 18.29,44.47 17.65,43.83 IC1.3
N$4
  Top 0.254: R7.1 R6.1 13.59,44.98 15.11,43.45 IC1.5
N$5
  Top 0.254: R4.2 30.27,47.22 31.24,46.25 31.24,44.51 R31.2 31.2,43.67 31.12,43.58 29.85,43.58 29.59,43.32 29.59,42.6 C5.2
N$6  (via drill 0.61)
  Top 0.254: R16.1 v17.02,32.4
  Bottom 0.254: v17.02,32.4 17.02,36.47 18.92,38.37 U$4.2
N$7  (via drill 0.61)
  Top 0.254: 25.65,45.78 R5.1 24.51,44.98 23.37,43.83 20.57,43.83 20.19,43.45 IC1.1 | 25.65,45.78 R4.1 26.67,38.63 27.94,37.36 29.67,37.36 D3.C D9.A | R6.2 v13.59,48.15 | v25.65,45.74 25.65,45.78
  Bottom 0.254: v13.59,48.15 25.02,48.15 25.65,47.52 v25.65,45.74
N$8
  Top 0.305: C5.1 31.37,42.56 31.62,42.31 D9.C D3.A
N$9
  Top 0.254: R8.2 8.89,44.98 10.16,43.71 12.32,43.71 12.57,43.45 IC1.7 12.57,39.26 13.08,38.75 14.73,38.75 15.11,38.37 IC1.10
N$10
  Top 0.305: R19.2 24.6,40.75 U$4.1
N$11  (via drill 0.61)
  Top 0.254: IC1.13 v18.92,34.18 19.3,33.8 21.84,33.8 23.24,32.4 R14.2 | v12.83,30.62 R13.1
  Bottom 0.254: v18.92,34.18 18.92,31.64 17.14,29.86 13.97,29.86 v12.83,30.62
N$12  (via drill 0.61)
  Top 0.254: R11.2 C3.1 7.41,28.61 D1.A 7.44,28.52 v7.49,28.47 | v10.92,28.47 10.74,28.47 D5.A 10.96,28.56 R13.2
  Bottom 0.254: v7.49,28.47 v10.92,28.47
N$13
  Top 0.254: D1.C D2.A 9.14,24.27 9.4,24.02 14.48,24.02 15.49,25.04 15.49,27.2 15.62,27.32 | 15.62,27.32 15.49,27.32 14.86,27.96 14.86,34.18 13.84,35.2 IC1.9 | 15.62,27.32 U$3.3
N$14  (via drill 0.61)
  Top 0.254: R11.1 C3.2 v9.14,30.24 | v12.7,28.47 D6.C | v18.92,29.99 R12.2
  Bottom 0.254: v9.14,30.24 11.81,30.24 12.7,29.35 | 12.7,29.35 v12.7,28.47 | 12.7,29.35 18.54,29.35 v18.92,29.99
N$15
  Top 0.254: D5.C D6.A 13.79,25.62 14.35,26.18 14.35,33.55 12.57,35.32 IC1.8
N$16
  Top 0.254: IC1.12 17.65,33.93 18.92,32.66 R12.1 R18.1
N$17
  Top 0.254: IC1.14 20.19,34.82 20.7,34.31 22.1,34.31 23.5,32.91 24.64,32.91 25.02,32.53 R15.2 24.09,31.73 24,31.64 24,30.12 23.88,29.99 23.03,29.99 R14.1
N$18  (via drill 0.61)
  Top 0.254: R18.2 21.5,30.03 21.84,30.37 21.84,32.53 v21.46,32.91
  Bottom 0.254: v21.46,32.91 20.96,33.42 20.96,35.83 21.34,36.21 24.38,36.21 U$4.3
N$19
  Top 0.254: IC5.5 48.64,37.36 IC2.5
  Bottom 0.254: U$5.3 59.69,36.09 53.85,36.09 53.47,36.47 IC2.5
N$20  (via drill 0.61)
  Top 0.254: IC5.6 47.37,36.85 IC2.6 | R22.2 v50.67,33.93 | v41.27,38.63 41.02,38.37 41.02,37.74 40.39,37.1 35.81,37.1 33.82,35.11 R20.1
  Bottom 0.254: v41.27,38.63 44.83,38.63 IC2.6 46.99,34.69 48.26,33.42 50.16,33.42 v50.67,33.93
N$21  (via drill 0.61)
  Top 0.254: IC5.2 v46.1,30.5 IC2.2 | R9.1 v51.05,29.74 | R10.2 33.82,29.95 v33.78,29.99 33.82,30.03 C6.1
  Bottom 0.254: v51.05,29.74 50.55,29.74 49.78,30.5 v46.1,30.5 | v33.78,29.99 33.78,30.24 33.91,30.37 36.32,30.37 36.7,29.99 43.31,29.99 IC2.2
N$22  (via drill 0.61)
  Top 0.254: IC5.1 44.83,31.77 IC2.1 | R10.1 v35.81,29.48 | 35.56,31.17 C6.2
  Top 0.381: R10.1 C6.2 R20.2
  Bottom 0.254: v35.81,29.48 41.27,29.48 IC2.1
N$23  (via drill 0.61)
  Top 0.254: IC5.7 46.1,37.48 45.09,36.47 IC2.7 | v51.18,31.64 R23.2 51.43,31.81 51.43,32.66 51.69,32.91 52.96,32.91 53.17,33.13 R22.1
  Bottom 0.254: v51.18,31.64 46.23,31.64 44.45,33.42 IC2.7
N$24
  Top 0.254: IC5.3 47.37,29.23 IC2.3
  Bottom 0.381: X1.1 16.89,18.94 17.14,18.94 16.64,19.45 16.64,23.39 17.65,24.4 24.13,24.4 27.43,27.7 30.86,27.7 31.12,27.45 46.48,27.45 46.99,27.96 IC2.3
N$25
  Top 0.254: LED3.5 R17.2
N$26
  Top 0.254: LED3.6 9.26,21.02 R21.2
N$27
  Top 0.381: R28.2 LED2.5
N$28
  Top 0.381: R29.2 88.74,15.64 LED2.6
N$29
  Top 0.381: R30.2 88.74,18.94 LED2.4
N$30
  Top 0.254: LED3.4 9.77,17.62 R24.2
N$31
  Top 0.381: LED1.5 49.06,24.78 R25.2
N$32
  Top 0.381: LED1.6 49.14,26.48 R26.2
N$33
  Top 0.381: LED1.4 49.11,23.08 R27.2
N$35  (via drill 0.61)
  Top 0.254: R32.2 v64.9,48.15 | v72.64,56.91 72.57,56.91 Q1.1
  Bottom 0.254: v64.9,48.15 64.9,48.66 65.15,48.91 65.15,53.23 68.83,56.91 v72.64,56.91
N$36
  Top 0.254: D12.A 60.49,57.68 SG2.- 60.75,58.73 61.21,59.2 73.36,59.2 Q1.3
N$37  (via drill 0.61)
  Top 0.254: IC3.2 80.26,42.56 R37.2 v80.26,45.74 | R3.2 v85.6,44.72
  Bottom 0.254: v85.6,44.72 80.39,44.72 80.26,44.85 v80.26,45.74
N$38  (via drill 0.61)
  Top 0.254: C11.2 77,47.48 77.34,47.13 77.34,45.86 77.47,45.74 78.32,45.74 | 78.32,45.74 C12.2 | 78.32,45.74 78.32,41.97 IC3.3 | R38.2 69.72,44.59 v70.23,44.09
  Bottom 0.254: v70.23,44.09 76.2,44.09 IC3.3
N$39
  Top 0.254: R40.2 R3.1 C15.2
N$40  (via drill 0.61)
  Top 0.254: 83.82,41.8 R40.1 R41.1 82.04,45.65 v82.17,45.99 | 83.82,41.8 IC3.1 | R42.2 v72.01,47.52 | 83.82,41.8 83.82,40.91 84.33,40.4 87.18,40.4 D23.C D24.A
  Bottom 0.254: 82.17,46.5 v82.17,45.99 82.17,47.77 81.53,48.4 72.9,48.4 v72.01,47.52
N$41
  Top 0.254: C12.1 78.36,48.53 78.74,48.91 81.66,48.91 82.17,48.4 R41.2
N$42
  Top 0.254: IC3.5 72.01,43.2 R42.1 R43.1
N$43
  Top 0.381: 73.53,33.55 IC3.10 73.53,35.7 72.01,37.23 69.6,37.23 68.45,38.37 IC3.7 67.44,42.69 R44.2
N$44  (via drill 0.61)
  Top 0.254: R48.2 81.53,28.47 v82.17,27.83 | v78.74,24.27 78.74,24.4 77.85,25.29 74.68,25.29 74.3,25.67 74.3,25.8 | 74.3,25.8 D19.A | 74.3,25.8 74.04,25.54 70.99,25.54 70.61,25.93 D17.A 70.4,27.08 C13.1 R46.2
  Bottom 0.254: v82.17,27.83 82.42,27.58 82.42,24.78 81.79,24.15 78.87,24.15 v78.74,24.27
N$45  (via drill 0.61)
  Top 0.254: v85.6,37.61 90.17,37.61 91.57,39.01 91.57,40.15 v91.69,40.4 | D18.A D17.C 69.27,23.97 68.96,24.27 68.96,32.02 IC3.9
  Bottom 0.254: U$7.3 v91.69,40.4 | v85.6,37.61 84.2,37.61 82.93,36.34 72.39,36.34 70.99,34.94 IC3.9
N$46
  Top 0.254: D20.C 76.07,27.7 75.82,27.96 73.66,27.96 | 73.66,27.96 73.66,29.06 R47.2 73.57,28.97 C13.2 R46.1 | D18.C 72.52,27.7 72.77,27.96 73.66,27.96
N$47
  Top 0.254: D20.A D19.C 74.3,23 73.79,22.5 69.47,22.5 68.45,23.51 IC3.8
N$48
  Top 0.254: 81.53,33.55 R48.1 82.34,30.97 82.68,30.62 82.68,29.61 82.93,29.35 83.73,29.35 R49.2
  Top 0.381: IC3.13 81.15,33.93 81.53,33.55
N$49
  Top 0.254: 79.5,32.15 76.58,32.15 75.44,31.01 75.44,29.14 R47.1
  Top 0.381: IC3.12 78.61,33.8 79.5,32.91 79.5,32.15 R52.1
N$50
  Top 0.254: R50.2 R49.1 83.82,33.93 IC3.14
N$51
  Top 0.254: D24.C D23.A C15.1
N$52
  Top 0.254: R53.1 77.09,27.83 77.98,26.94 83.44,26.94 83.69,26.69 U$8.2
N$53  (via drill 0.61)
  Top 0.254: R54.2 86.49,38.75 v86.61,38.63
  Bottom 0.254: v86.61,38.63 87,38.37 87.38,37.99 87.38,26.69 U$8.1
N$54  (via drill 0.61)
  Top 0.254: R52.2 v79.5,29.23
  Bottom 0.254: v79.5,29.23 79.5,26.31 80.26,25.54 U$8.3
N$55
  Top 0.61: D13.C 51.25,2.63 POWER.8
N$62
  Top 0.381: R61.1 83.08,11.83 S1.2
N$63
  Top 0.381: S2.2 83.08,7.38 R62.1 R71.2
N$64
  Top 0.381: R63.1 LED.C
N$68
  Top 0.254: U$1.1 54.61,42.69 Q7.1
N$69
  Top 0.254: U$1.2 54.99,43.96 Q7.2
N$72  (via drill 0.61)
  Top 0.254: v48.51,45.23 U$1.3
  Bottom 0.254: G1.+ 38.6,42.81 38.99,43.2 45.97,43.2 48.01,45.23 v48.51,45.23
PA1  (via drill 0.61)
  Top 0.254: v95.25,46.12 R70.2 | XIO.4 104.76,48.29 JP8.2
  Bottom 0.254: JP8.2 104.78,47.9 103.89,47.01 95.38,47.01 95.25,46.88 v95.25,46.12
PB4  (via drill 0.61)
  Top 0.254: LED3.2 4.7,19.32 5.33,19.96 5.33,50.06 9.4,54.12 24.89,54.12 25.53,53.48 25.53,49.42 26.42,48.53 30.23,48.53 v30.61,48.91
  Bottom 0.254: v30.61,48.91 41.66,48.91 42.04,49.29 42.04,50.79 JP6.8
PB5
  Top 0.254: LED1.1 40.21,26.86 40,27.07 33.15,27.07 32.38,27.83 32.38,34.43 35.43,37.48 35.43,48.02 36.07,48.66 37.97,48.66 39.5,50.18 39.5,50.79 JP6.7
PB6
  Top 0.254: LED1.2 39.24,25.16 37.85,26.56 32.89,26.56 31.88,27.58 31.88,34.82 34.92,37.86 34.92,48.76 JP6.6
PB7
  Top 0.254: LED1.3 39.67,23.46 37.08,26.05 32.51,26.05 31.37,27.2 31.37,35.07 34.42,38.12 34.42,50.79 JP6.5
PH5
  Top 0.254: JP6.10 47.14,52.19 46.1,53.23 27.56,53.23 25.65,55.14 8.76,55.14 4.32,50.69 4.32,24.66 1.27,21.61 1.27,18.05 1.65,17.67 3.39,17.67 LED3.3
PH6
  Top 0.254: JP6.9 44.6,52.19 44.07,52.72 27.3,52.72 25.4,54.63 9.02,54.63 4.83,50.44 4.83,22.66 LED3.1
PH_OUT  (via drill 0.61)
  Top 0.254: 54.56,32.02 D10.A
  Top 0.381: v56.77,29.1 D4.C D10.A 54.56,31.77 R23.1
  Bottom 0.381: ADCL.2 58.79,26.07 56.77,28.08 v56.77,29.1
PL1  (via drill 0.61)
  Top 0.254: v93.6,15.51 93.92,15.26 LED2.1
  Bottom 0.254: XIO.29 94.12,15.27 v93.6,15.51
PL3  (via drill 0.61)
  Top 0.254: v93.6,17.29 LED2.2
  Bottom 0.254: XIO.27 99.07,17.81 98.55,17.29 v93.6,17.29
PL5  (via drill 0.61)
  Top 0.254: v94.62,18.94 93.64,18.94 LED2.3
  Bottom 0.254: XIO.25 99.33,20.35 97.92,18.94 v94.62,18.94
PWM1
  Top 0.254: PWML.8 51.19,51.59 53.59,53.99 57.91,53.99 58.8,54.88 76.2,54.88 U$6.16
PWM2
  Top 0.254: U$6.14 78.23,54.37 59.05,54.37 58.17,53.48 54.86,53.48 53.72,52.34 53.72,50.82 PWML.7
PWM3
  Top 0.254: PWML.6 56.27,52.48 56.77,52.98 58.42,52.98 59.31,53.87 80.26,53.87 U$6.12
PWM4
  Top 0.254: PWML.5 58.81,52.61 59.56,53.36 82.3,53.36 U$6.10
PWM5
  Top 0.254: PWML.4 61.35,48.65 61.85,48.15 R32.1
RESET  (via drill 0.61)
  Top 0.254: S3.A2 34.51,18.4 33.65,17.54 33.65,5.99 v34.67,4.97
  Bottom 0.254: v34.67,4.97 37.59,4.97 38.48,4.08 38.48,2.58 POWER.3
RST
  Top 0.381: ESP_ADAPTER.4 77.98,15.89 78.99,14.88 78.99,11.87 R61.2
RX
  Bottom 0.381: ESP_ADAPTER.1 73.03,18.94 74.04,19.96 85.47,19.96 88.01,22.5 88.01,44.47 84.2,48.28 COMMUNICATION.4
SCL
  Bottom 0.254: COMMUNICATION.1 90.93,51.71 90.93,56.28 90.3,56.91 77.6,56.91 76.96,57.55 U$6.15
SCL1  (via drill 0.61)
  Top 0.254: R68.2 v41.15,45.48 41.4,45.23 U$1.6
  Bottom 0.254: JP6.1 24.38,50.72 24.38,50.06 26.92,47.52 38.35,47.52 40.51,45.36 41.15,45.36 v41.15,45.48
SDA
  Top 0.254: U$6.13 79.5,57.17 79.76,56.91 88.01,56.91 88.39,56.53 88.39,51.71 COMMUNICATION.2
SDA1  (via drill 0.61)
  Top 0.254: 42.89,46.12 R69.2 | U$1.5 43.01,46.5 R69.2 | R69.2 42.76,46.28 v42.67,46.37
  Bottom 0.254: v42.67,46.37 40.26,46.37 38.61,48.02 27.56,48.02 26.8,48.79 26.8,50.79 JP6.2
TX
  Bottom 0.381: ESP_ADAPTER.8 76.33,10.81 79.25,13.73 79.25,17.16 81.15,19.07 85.6,19.07 88.77,22.24 88.77,44.72 86.49,47.01 86.61,50.72 COMMUNICATION.3
V+  (via drill 0.61, 0.81)
  Top 0.381: IC1.4 16.38,40.02 17.4,39.01 22.06,39.01 21.84,38.79 v21.84,35.2 | v49.53,12.97 49.53,19.96 48.01,21.48 44.96,21.48 43.69,22.75 43.69,26.81 42.8,27.7 40.89,27.7 40.13,28.47 v40.13,31.01 40.13,35.83 40.77,36.47 IC2.8 41.91,37.61 43.11,38.81 IC5.8 44.83,40.53 v45.34,41.04 | v49.4,10.43 49.4,8.65 v51.43,6.62
  Top 0.61: 54.23,6.75 61.47,6.75 63.25,4.97 95.25,4.97 97.28,7 97.28,32.28 v96.27,33.29 | 54.23,6.75 51.82,6.75 51.69,6.62 v51.43,6.62 | 54.23,5.3 D13.A 54.15,6.67 54.23,6.75 | IC3.4 76.07,38.37 77.22,37.23 81.28,37.23 | v90.04,35.07 88.65,36.47 84.96,36.47 84.2,37.23 81.28,37.23 | R54.1 81.32,37.32 81.28,37.23 | 22.06,39.01 R19.1
  Bottom 0.381: v49.53,12.97 49.53,10.56 v49.4,10.43 | v21.84,35.2 21.84,34.82 25.65,31.01 36.58,31.01 36.96,30.62 39.75,30.62 v40.13,31.01
  Bottom 0.61: v96.27,33.29 94.23,33.29 92.46,35.07 v90.04,35.07
  Bottom 0.813: v51.43,6.62 33.27,6.49 28.45,1.67 4.83,1.67 1.65,4.84 1.65,49.93 5.71,53.99 47.12,53.99 47.75,54.63 U$2.8 U$2.6
V-  (via drill 0.61)
  Top 0.254: R53.2 77.3,30.97 v77.34,31.01 | IC5.4 v48.64,34.31
  Top 0.381: v85.22,32.02 85.47,32.28 90.68,32.28 92.71,34.31 92.71,48.66 | v62.48,20.59 v52.96,20.59 52.96,27.07 51.94,28.08 49.91,28.08 49.53,28.47 IC2.4 48.64,29.74 IC5.4 | IC1.11 16.38,34.94 15.49,34.05 15.49,29.23 16,28.72 17.27,28.72 | 17.27,28.72 24.38,28.72 27.69,25.42 36.83,25.42 41.66,20.59 47.12,20.59 v47.37,20.34 | R16.2 17.02,28.97 17.27,28.72
  Bottom 0.305: 51.56,55.01 51.56,56.15
  Bottom 0.381: v85.22,32.02 77.34,32.02 | 77.34,32.02 76.07,33.29 IC3.11 | 77.34,32.02 v77.34,31.01 77.34,21.99 76.96,21.61 63.5,21.61 v62.48,20.59 | v47.37,20.34 52.7,20.34 v52.96,20.59 | v48.64,34.31 48.64,35.2 48.26,35.58 48.26,42.44 49.66,43.83 49.66,52.98 51.56,54.88 51.56,55.01 | 51.56,56.15 51.56,56.91 U$2.5